# EAGLE schematic motion-PIR-18650 (EAGLE 7.7.0)
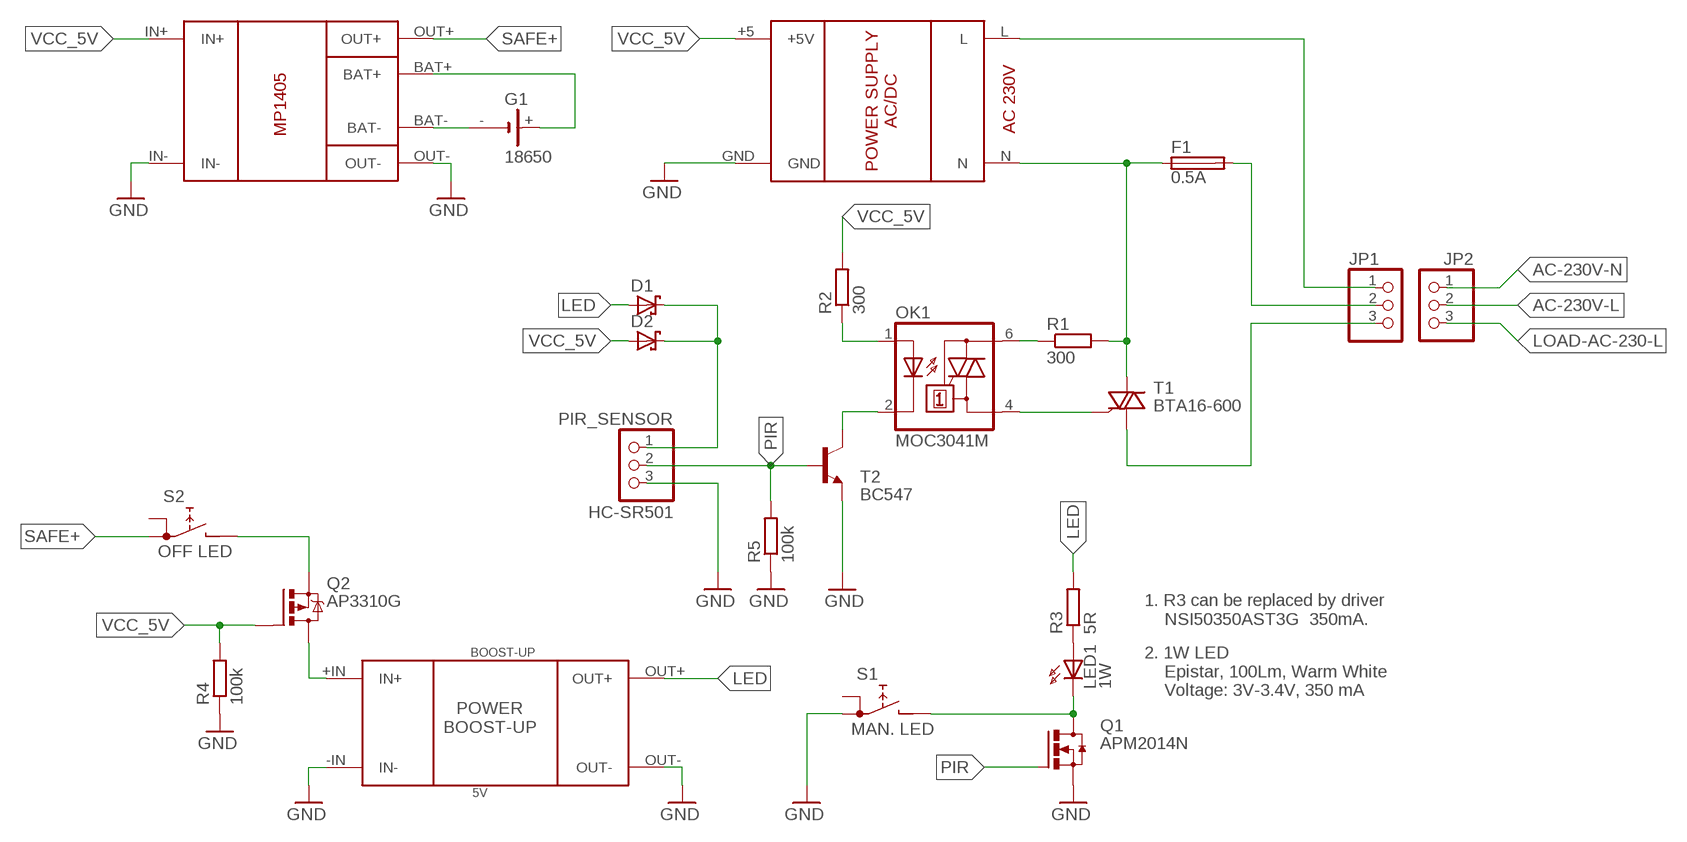
[diagram p0: schematic, sheet 1]

## Parts
1  1  POWER_CHARGER+5PS1  [POWER-PAC]
BOOST-UP  5V  POWER-BOOST-UP  [POWER-BOOST-PAC]
D1  BAS40  [SOT23]
D2  BAS40  [SOT23]
F1  0.5A  FUSEBLANK_5X20MM  [FUSE_HOLDER_5X20MM]
G1  18650  SL-160AA/PT  [SL-160AA/PT]
JP1  PINHD-1X3  [1X03]
JP2  PINHD-1X3  [1X03]
LED1  1W  HLMP6  [HLMP6]
OK1  MOC3041M  MOC3021M  [DIL06]
PIR_SENSOR  HC-SR501  PINHD-1X3  [1X03]
Q1  APM2014N  IRFP250  [TO-247AD-V]
Q2  AP3310G  IRF4905  [TO220BH]
R1  300  R-EU_0204/7  [0204/7]
R2  300  R-EU_0204/7  [0204/7]
R3  5R  R-EU_0204/2V  [0204V]
R4  100k  R-EU_0204/2V  [0204V]
R5  100k  R-EU_0204/2V  [0204V]
S1  MAN. LED  RDT1034  [RDT1034]
S2  OFF LED  RDT1034  [RDT1034]
T1  BTA16-600  BT138-H  [TO220BH]
T2  BC547  [TO92]
U$1  MP1405  [MP1405-PAC]
U$2  POWER-BOOST-UP  [POWER-BOOST-PAC]  (not placed on a sheet)

## Nets
AC-230V-L: F1.2 JP1.2
AC-230V-N: F1.1 JP1.1 R1.2 T1.T2(A2)
GND: BOOST-UP.-IN(IN-) BOOST-UP.OUT- PIR_SENSOR.3 Q1.S R4.1 R5.1 S1.A1 T2.1(E) U$1.IN- U$1.OUT-
LED: BOOST-UP.OUT+ D1.1(A) R3.2
LOAD-AC-230-L: JP1.3 T1.T1(A1)
N$1: LED1.K Q1.D S1.B
N$2: OK1.6(A2) R1.1
N$3: OK1.4(A1) T1.G
N$4: JP2.1
N$5: OK1.1(A) R2.1
N$6: OK1.2(C) T2.3(C)
N$7: JP2.2
N$8: JP2.3
N$9: G1.+ U$1.BAT+
N$10: G1.- U$1.BAT-
N$11: LED1.A R3.1
N$13: Q2.S S2.B
N$14: BOOST-UP.+IN(IN+) Q2.D
PIR: PIR_SENSOR.2 Q1.G R5.2 T2.2(B)
SAFE+: S2.A1 U$1.OUT+
SAFE++: D1.3(C) D2.3(C) PIR_SENSOR.1
VCC_5V: D2.1(A) Q2.G R2.2 R4.2 U$1.IN+
Unconnected: 1.+5(+5V) 1.GND 1.L 1.N G1.-@1(-) S1.A S2.A U$2.+IN(IN+) U$2.-IN(IN-) U$2.OUT+ U$2.OUT-

## Notes on the sheet
- 1. R3 can be replaced by driver
      NSI50350AST3G  350mA.
- 2. 1W LED
      Epistar, 100Lm, Warm White
      Voltage: 3V-3.4V, 350 mA

## Library data of the parts
1 = lex-library:POWER_CHARGER+5: Mobile Charger +5V
BOOST-UP U$2 = lex-library:POWER-BOOST-UP
D1 D2 = diode:BAS40: Silicon Schottky Diodes General-purpose diode for high-speed switching
F1 = fuse:FUSE: Fuse; OC_FARNELL: unknown; OC_NEWARK: unknown
G1 = battery:SL-160AA/PT: LI BATTERY Sonnenschein
JP1 JP2 PIR_SENSOR = pinhead:PINHD-1X3: PIN HEADER
LED1 = display-hp:HLMP6: LED 2mm horizontal; MF: AGILENT TECHNOLOGIES; MPN: HLMP-6500; OC_FARNELL: 1652490; OC_NEWARK: 40K0088
OK1 = optocoupler:MOC30*M: RANDOM-PHASE OPTOISOLATORS TRIAC DRIVER OUTPUT Source: http://www.fairchildsemi.com MOC3020-M.pdf; MF: FAIRCHILD SEMICONDUCTOR; MPN: MOC3021-M; OC_FARNELL: 1021365; OC_NEWARK: 95B7895
Q1 = transistor-power:IRFP25*: 33A/27A, 200V/150V, 0.085/0.012 Ohm, N-Channel Power MOSFET Source: Fairchild Semiconductor Corporation
Q2 = transistor-power:IRF4905: P-Channel HEXFET® Power MOSFET RDS(on)= 0.02 Ohm, ID = -74A Source: http://www.irf.com/product-info/datasheets/data/irf4905pbf.pdf
R1 R2 = rcl:R-EU_: RESISTOR, European symbol
R3-R5 = resistor:R-EU_: RESISTOR, European symbol
S1 S2 = switch:RDT1034: PUSH SWITCH www.radiohm.com
T1 = triac:BT138: TRIAC Source: http://www.semiconductors.philips.com BT138_SERIES_2.pdf
T2 = transistor:BC547: NPN TRANSISTOR
U$1 = lex-library:MP1405: POWER